# Altium schematic sheet SD.SchDoc
size A4
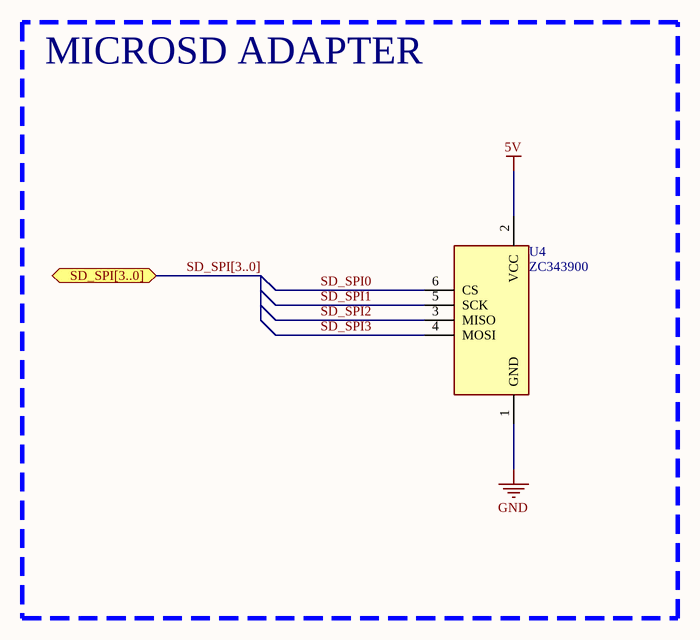
[diagram p0: SD.SchDoc]

## Parts
U4  ZC343900  [ZC343900]

## Blocks framed on the sheet
MICROSD ADAPTER: U4

## Ports
SD_SPI[3..0] (bidir)

## Nets
5V: U4.2(VCC)
GND: U4.1(GND)
SD_SPI0: U4.6(CS)
SD_SPI1: U4.5(SCK)
SD_SPI2: U4.3(MISO)
SD_SPI3: U4.4(MOSI)

## Buses and harness runs
bus SD_SPI[3..0] = port SD_SPI[3..0]

## Library data of the parts
U4 = ZC343900: MicroSD Adapter